# EasyEDA Pro project ProPrj_PMS5003-feathwerwing-v1_2025-06-30.epro

# Schematic Schematic1
Board Name: Board1; Create Date: 2025-02-05; Page Name: P1; Project Name: PMS5003-feathwerwing; Schematic Name: Schematic1; Update Date: 2025-02-17; Company: EasyEDA.com; Page Size: A4; Version: V1.0
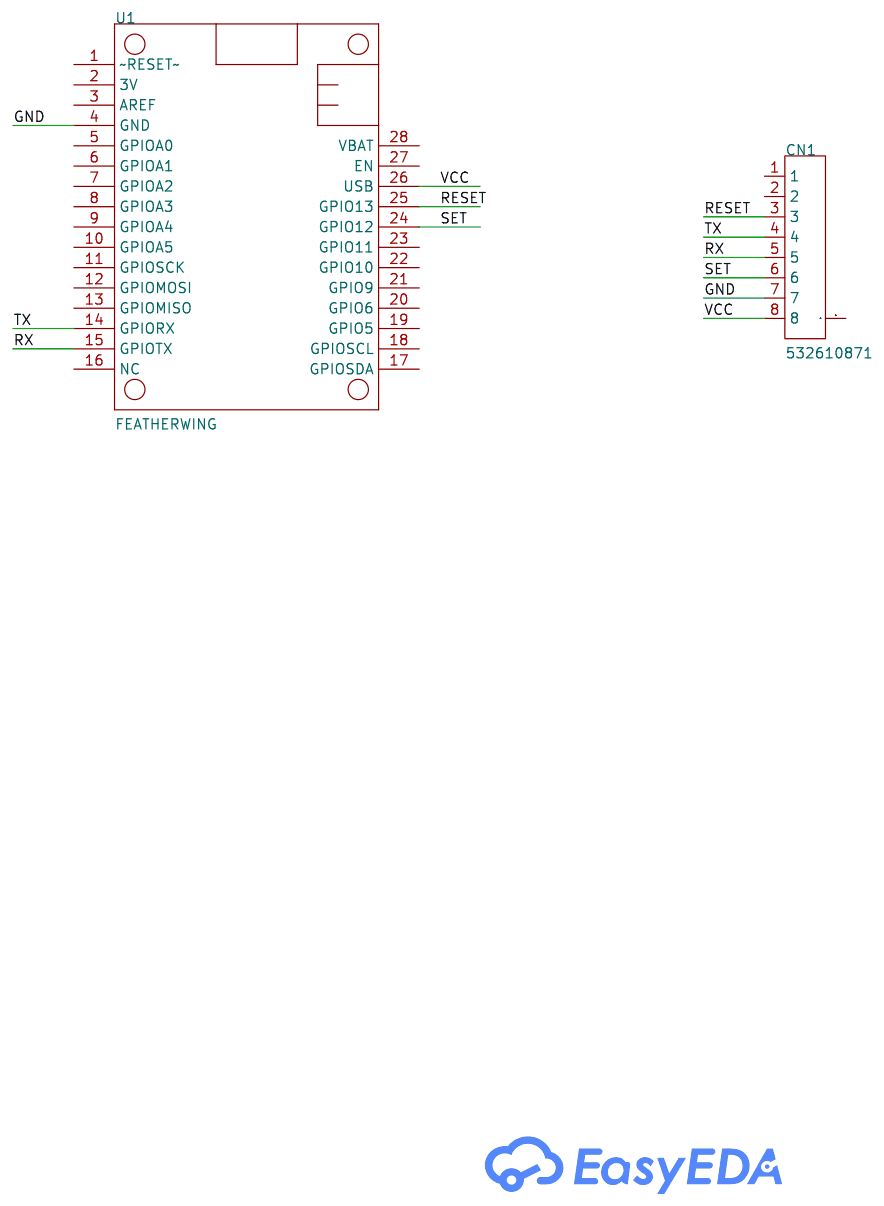
[diagram p0: schematic sheet]

## Parts
CN1  532610871  [CONN-SMD_532610871]
U1  FEATHERWING  [FEATHERWING]

## Library data of the parts
CN1 = 532610871: Pins Structure:1x8P Pitch:1.25mm Mounting Style:Horizontal attachment Reference Series:PicoBlade(MX 1.25) Number of Pins:8P Number of Rows:1 Number of PINs Per Row:8 Row Spacing:- Current Rating (Max):1A Contact Material:Phosphor Bronze Contact Plating:Ti; LCSC Part Name: 1x8P 间距:1.25mm 卧贴 系列:PicoBlade(MX 1.25); Supplier Part: C293349; Manufacturer: MOLEX; Supplier Footprint: SMD,P=1.25mm; JLCPCB Part Class: Extended Part; Datasheet: https://www.molex.com/content/dam/molex/molex-dot-com/products/automated/en-us/salesdrawingpdf/532/53261/532610871_sd.pdf?inline\; Supplier: LCSC; Pins Structure: 1x8P; Pitch: 1.25mm; Mounting Style: Horizontal attachment; Reference Series: PicoBlade(MX 1.25); Number of Pins: 8P; Number of Rows: 1; Number of PINs Per Row: 8; Current Rating (Max): 1A; Contact Material: Phosphor Bronze; Contact Plating: Tin; Operating Temperature Range: -40℃~+105℃; Rated Voltage (Max): 125V; Plastic Material: Fiberglass Reinforced PA; Flame Retardant Rating: UL94V-0; Supplementary Features: Auxiliary soldering legs; Colour: White; Z-Height of the Board: 3.4mm; X-Length of Bottom Edge on Board (Spacing Line): 15.15mm; Y-Width of Bottom Edge on Board: 5.2mm
U1 = FEATHERWING

## Nets
GND: CN1.7 U1.4(GND)
VCC: CN1.8 U1.26(USB)
RESET: CN1.3 U1.25(GPIO13)
RX: CN1.5 U1.15(GPIOTX)
SET: CN1.6 U1.24(GPIO12)
TX: CN1.4 U1.14(GPIORX)

Not connected (* = marked no-connect by the designer): CN1 0 1 2; U1 1(~RESET~) 2(3V) 3(AREF) 5(GPIOA0) 6(GPIOA1) 7(GPIOA2) 8(GPIOA3) 9(GPIOA4) 10(GPIOA5) 11(GPIOSCK) 12(GPIOMOSI) 13(GPIOMISO) 16(NC) 17(GPIOSDA) 18(GPIOSCL) 19(GPIO5) 20(GPIO6) 21(GPIO9) 22(GPIO10) 23(GPIO11) 27(EN) 28(VBAT)

# Board PCB1
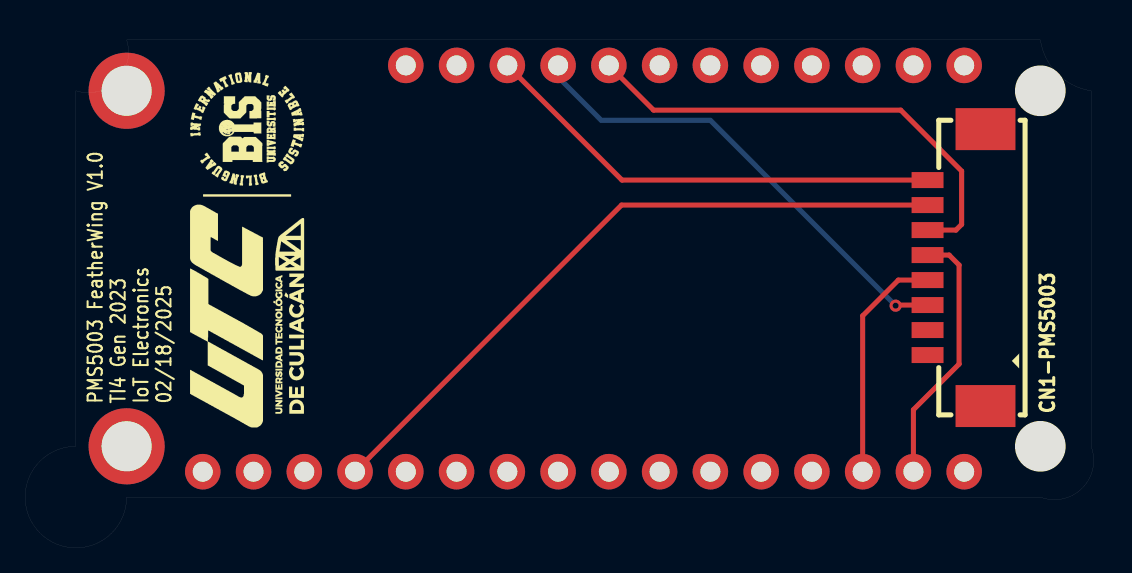
[diagram p1: board, top side]
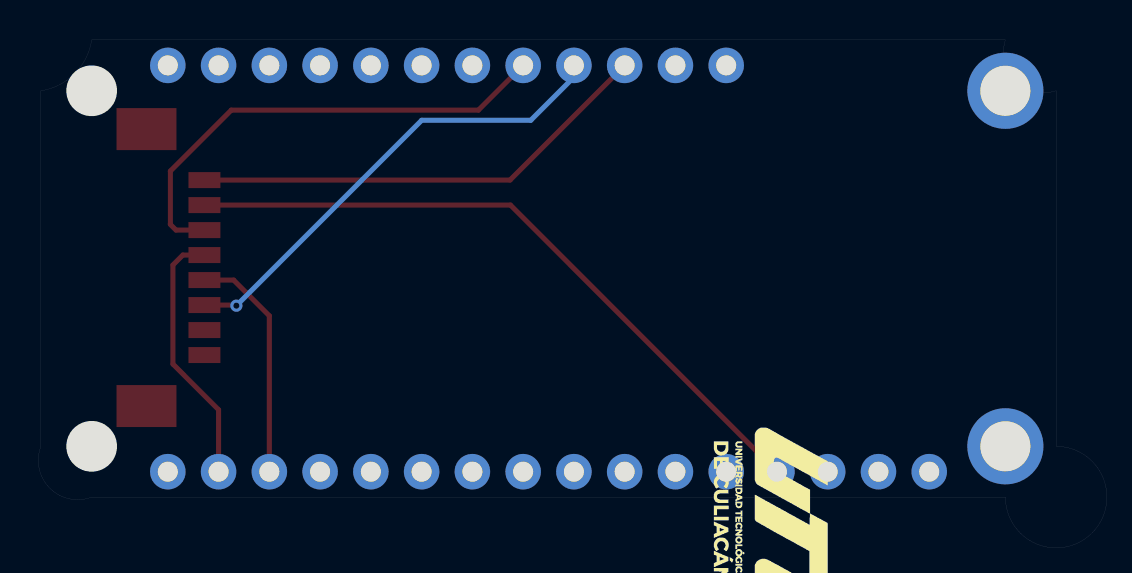
[diagram p2: board, bottom side, seen from below]

Outline 50.8 x 22.86 mm; copper layers: Top Layer, Bottom Layer. Coordinates in mm from the lower left corner of the outline.
Stack: Top Layer 0.035mm / Dielectric1 1.51mm FR4 er 4.5 / Bottom Layer 0.035mm

## Design rules (mm)
template: JLCPCB Capability(Two Layers Board)
spacing copperThickness1oz (default): track to track 0.102, other pairs 0.152 to 0.3
spacing copperThickness2oz: track to track 0.203, other pairs 0.152 to 0.3
track width copperThickness1oz (default): min 0.127, default 0.254, max 2.54
track width copperThickness2oz: min 0.203, default 0.254, max 2.54
differential pair differentialPair (default): width min 0.127, default 0.254, max 2.54; gap min 0.152, default 0.152
via viaSize (default): diameter min 0.5, default 0.61, max 10; hole min 0.3, default 0.305, max 6.3

## Placement (name value [footprint] x y rotation side)
CN1-PMS5003  532610871  [CONN-SMD_532610871]  44.07 11.48 90 top
U1  -  [FEATHERWING]  0 0 0 top

## Footprints (pads in the part's own frame, mm; a bottom-side part is the same pattern mirrored in y, then rotated)
CONN-SMD_532610871
  rect 2.1x3 smd: 0(-6.925,-1.45) 0(6.925,-1.45)
  rect 0.8x1.6 smd: 1(-4.375,1.45) 2(-3.125,1.45) 3(-1.875,1.45) 4(-0.625,1.45) 5(0.625,1.45) 6(1.875,1.45) 7(3.125,1.45) 8(4.375,1.45)
FEATHERWING
  round 1.778 hole 1: 1(6.35,1.27) 2(8.89,1.27) 3(11.43,1.27) 4(13.97,1.27) 5(16.51,1.27) 6(19.05,1.27) 7(21.59,1.27) 8(24.13,1.27) 9(26.67,1.27) 10(29.21,1.27) 11(31.75,1.27) 12(34.29,1.27) 13(36.83,1.27) 14(39.37,1.27) 15(41.91,1.27) 16(44.45,1.27) 17(44.45,21.59) 18(41.91,21.59) 19(39.37,21.59) 20(36.83,21.59) 21(34.29,21.59) 22(31.75,21.59) 23(29.21,21.59) 24(26.67,21.59) 25(24.13,21.59) 26(21.59,21.59) 27(19.05,21.59) 28(16.51,21.59)
  round 3.81 hole 2.5: P$1(2.54,20.32) P$2(2.54,2.54)

## Nets
GND: CN1-PMS5003.7 U1.4
VCC: CN1-PMS5003.8 U1.26
RESET: CN1-PMS5003.3 U1.25
RX: CN1-PMS5003.5 U1.15
SET: CN1-PMS5003.6 U1.24
TX: CN1-PMS5003.4 U1.14

Pads without a net: CN1-PMS5003 0 1 2; U1 1 2 3 5 6 7 8 9 10 11 12 13 16 17 18 19 20 21 22 23 27 28 P$1 P$2

## Via types
v1: diameter 0.61, hole 0.305, Top Layer to Bottom Layer, 1 via

## Routing (per net, layer and track width the routed paths; a pad name or vN(x,y) marks a point on that pad's centre or on a via; arc(x,y) is an arc through that point)
GND: length 34.2
  Top Layer w0.254: CN1-PMS5003.7 27.3,14.6 U1.4
VCC: length 23.4
  Top Layer w0.254: U1.26 27.33,15.85 CN1-PMS5003.8
RESET: length 23.8
  Top Layer w0.254: CN1-PMS5003.3 41.05,9.6 v1(41.02,9.57)
  Bottom Layer w0.254: v1(41.02,9.57) 31.74,18.84 26.28,18.84 24.13,21 U1.25
RX: length 13.1
  Top Layer w0.254: CN1-PMS5003.5 43.7,12.1 44.19,11.61 44.19,6.65 41.91,4.37 U1.15
SET: length 24.3
  Top Layer w0.254: CN1-PMS5003.6 44.04,13.35 44.32,13.64 44.32,16.3 41.27,19.35 28.91,19.35 U1.24
TX: length 11.8
  Top Layer w0.254: U1.14 39.37,9.06 41.15,10.85 CN1-PMS5003.4

## Text on the board
Top Silkscreen Layer: PMS5003 FeatherWing V1.0 / TI4 Gen 2023 / IoT Electronics / 02/18/2025
